# Altium schematic sheet MAIN.SchDoc: MAIN BLOCK
size A4; Date: 14.06.2022; Revision: V1.0; SheetNumber: 1; SheetTotal: 5; ProjectRevision: V1.0; DOC_NO_SCH_DWG: #012022051400
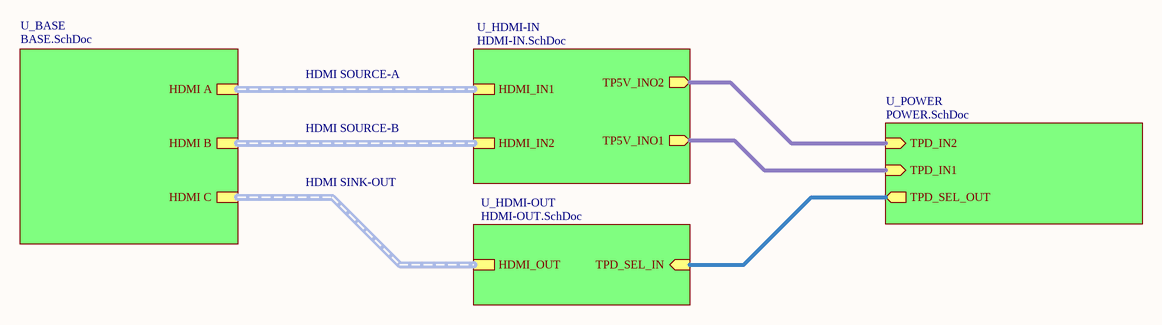
[diagram p0: MAIN.SchDoc]

## Sub-sheets
U_BASE = BASE.SchDoc: HDMI A (harness HDMI A), HDMI B (harness HDMI B), HDMI C (harness HDMI C)
U_HDMI-IN = HDMI-IN.SchDoc: HDMI_IN1 (harness HDMI_IN1), HDMI_IN2 (harness HDMI_IN2), TP5V_INO2 (out), TP5V_INO1 (out)
U_HDMI-OUT = HDMI-OUT.SchDoc: HDMI_OUT (harness HDMI_OUT), TPD_SEL_IN (in)
U_POWER = POWER.SchDoc: TPD_IN2 (in), TPD_IN1 (in), TPD_SEL_OUT (out)

## Nets
(unnamed): sheet U_HDMI-IN/TP5V_INO2, sheet U_POWER/TPD_IN2
(unnamed): sheet U_HDMI-IN/TP5V_INO1, sheet U_POWER/TPD_IN1
(unnamed): sheet U_HDMI-OUT/TPD_SEL_IN, sheet U_POWER/TPD_SEL_OUT

## Buses and harness runs
harness sheet U_BASE/HDMI A = sheet U_HDMI-IN/HDMI_IN1
harness sheet U_BASE/HDMI B = sheet U_HDMI-IN/HDMI_IN2
harness sheet U_BASE/HDMI C = sheet U_HDMI-OUT/HDMI_OUT

## Notes on the sheet
- HDMI SOURCE-A
- HDMI SOURCE-B
- HDMI SINK-OUT
- THIS DOCUMENT AND THE DATA DISCLOSED HEREIN OR
- HEREWITH IS THE PROPERTY OF SPD Ind.
- ENG:
- DHARAGESWARAN S
- APPROVALS
- DATE
- PROJECT
- DSN:
- CHK:
- REFERENCE DOCUMENTS
- PROJECT REVISION:
- TITLE
- DOCUMENT REVISION:
- Email: sdhamuvkl@gmail.com <https://github.com/DhamuVkl>
- BOM:
- FAB DWG:
- PCB DWG:
- ASSY DWG:
- SCALE:
- A4
- SIZE
- CAGE CODE
- FILE NAME
- DWG NO.
- SHEET
- REV
- OF